# EAGLE design snes_visualization_combi (EAGLE 9.6.2)

## Sheet 1 of 2
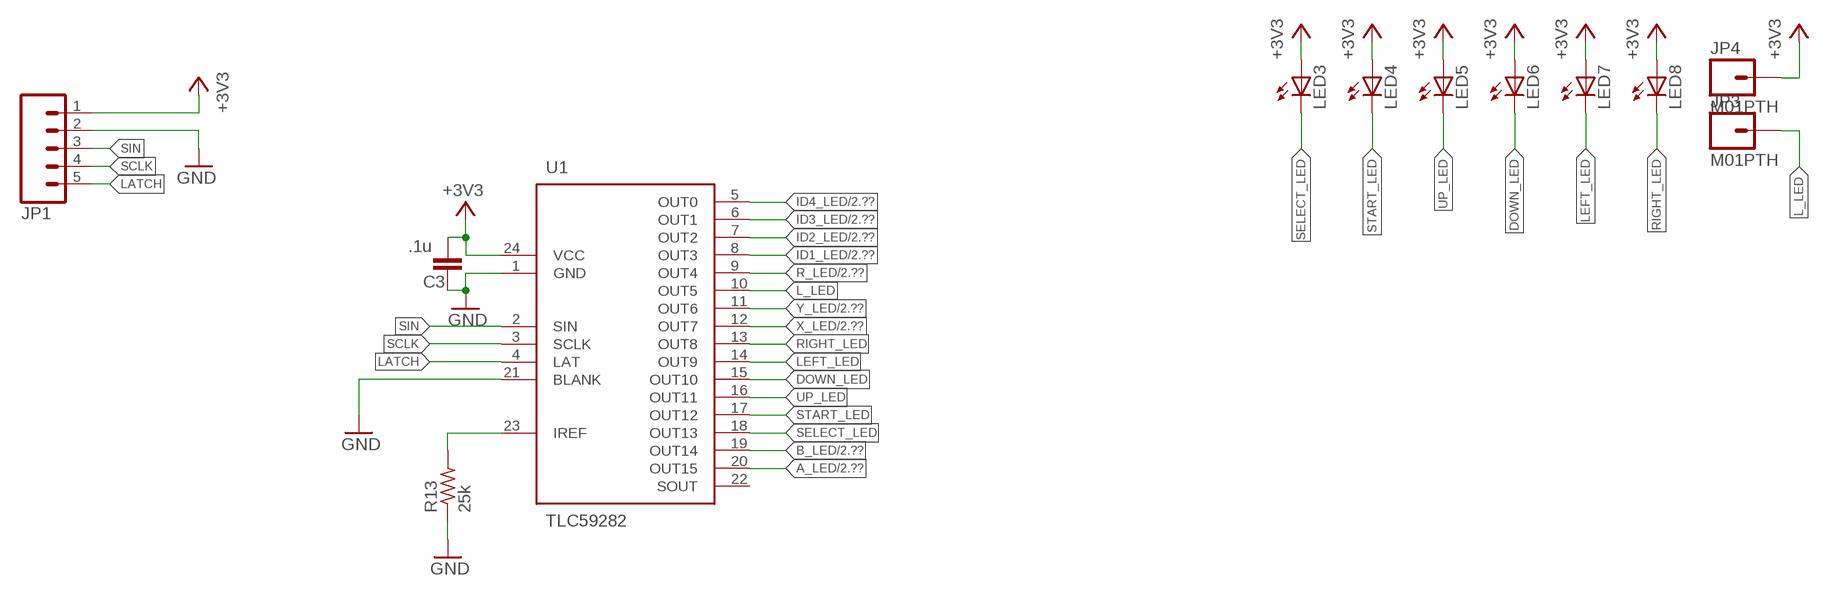
[diagram p0: schematic, sheet 1]

### Parts
C3  .1u  C-EUC0603  [C0603]
JP1  M05PTH  [1X05]
JP3  M01PTH  [1X01]
JP4  M01PTH  [1X01]
LED3  LED3MM  [LED3MM]
LED4  LED3MM  [LED3MM]
LED5  LED5MM  [LED5MM]
LED6  LED5MM  [LED5MM]
LED7  LED5MM  [LED5MM]
LED8  LED5MM  [LED5MM]
R13  25k  R-US_R0805  [R0805]
U1  TLC59282  [R-PDSO-G24]

### Nets
+3V3: C3.1 JP1.1 JP4.1 LED3.A LED4.A LED5.A LED6.A LED7.A LED8.A U1.24(VCC) ; also sheet 2
A_LED: U1.20(OUT15) ; also sheet 2
B_LED: U1.19(OUT14) ; also sheet 2
DOWN_LED: LED6.K(C) U1.15(OUT10)
GND: C3.2 JP1.2 R13.1 U1.1(GND) U1.21(BLANK)
ID1_LED: U1.8(OUT3) ; also sheet 2
ID2_LED: U1.7(OUT2) ; also sheet 2
ID3_LED: U1.6(OUT1) ; also sheet 2
ID4_LED: U1.5(OUT0) ; also sheet 2
L_LED: JP3.1 U1.10(OUT5)
LATCH: JP1.5 U1.4(LAT)
LEFT_LED: LED7.K(C) U1.14(OUT9)
N$5: R13.2 U1.23(IREF)
R_LED: U1.9(OUT4) ; also sheet 2
RIGHT_LED: LED8.K(C) U1.13(OUT8)
SCLK: JP1.4 U1.3(SCLK)
SELECT_LED: LED3.K(C) U1.18(OUT13)
SIN: JP1.3 U1.2(SIN)
START_LED: LED4.K(C) U1.17(OUT12)
UP_LED: LED5.K(C) U1.16(OUT11)
X_LED: U1.12(OUT7) ; also sheet 2
Y_LED: U1.11(OUT6) ; also sheet 2
Unconnected: U1.22(SOUT)

## Sheet 2 of 2
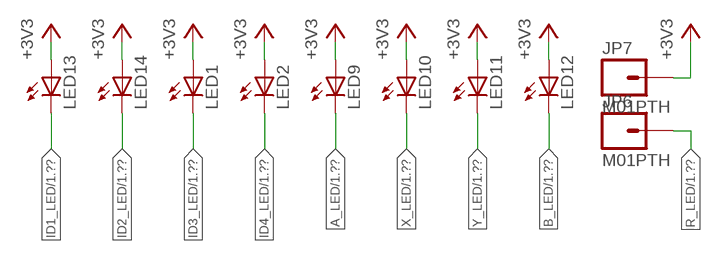
[diagram p1: schematic, sheet 2]

### Parts
JP6  M01PTH  [1X01]
JP7  M01PTH  [1X01]
LED1  LED5MM  [LED5MM]
LED2  LED5MM  [LED5MM]
LED9  LED5MM  [LED5MM]
LED10  LED5MM  [LED5MM]
LED11  LED5MM  [LED5MM]
LED12  LED5MM  [LED5MM]
LED13  LED5MM  [LED5MM]
LED14  LED5MM  [LED5MM]

### Nets
+3V3: JP7.1 LED1.A LED2.A LED9.A LED10.A LED11.A LED12.A LED13.A LED14.A ; also sheet 1
A_LED: LED9.K(C) ; also sheet 1
B_LED: LED12.K(C) ; also sheet 1
ID1_LED: LED13.K(C) ; also sheet 1
ID2_LED: LED14.K(C) ; also sheet 1
ID3_LED: LED1.K(C) ; also sheet 1
ID4_LED: LED2.K(C) ; also sheet 1
R_LED: JP6.1 ; also sheet 1
X_LED: LED10.K(C) ; also sheet 1
Y_LED: LED11.K(C) ; also sheet 1

## Library data of the parts
C3 = rcl:C-EU: CAPACITOR, European symbol; MOUSER#: 80-C0603C104K5R
JP1 = SparkFun-Connectors:M05: Header 5 Standard 5-pin 0.1" header. Use with straight break away headers (SKU : PRT-00116), right angle break away headers (PRT-00553), swiss pins (PRT-00743), machine pins (PRT-00117), and female headers (PRT-00115). Molex polarized connector foot print use with SKU : PRT-08230 with associated crimp pins and housings.
JP3 JP4 JP6 JP7 = SparkFun-Connectors:M01: Header 1 Standard 1-pin 0.1" header. Use with straight break away headers (SKU : PRT-00116), right angle break away headers (PRT-00553), swiss pins (PRT-00743), machine pins (PRT-00117), and female headers (PRT-00115).
LED1-LED14 = led:LED: LED OSRAM: - CHIPLED LG R971, LG N971, LY N971, LG Q971, LY Q971, LO R971, LY R971 LH N974, LH R974 LS Q976, LO Q976, LY Q976 LO Q996 - Hyper CHIPLED LW Q18S LB Q993, LB Q99A, LB R99A - SideLED LS A670, LO A670, LY A670, LG A670, LP A670 LB A673, LV A673, LT A673, LW A673 LH A674 LY A675 LS A676, LA A676, LO A676, LY A676, LW A676 LS A679, LY A679, LG A679 - Hyper Micro SIDELED® LS Y876, LA Y876, LO Y876, LY Y876 LT Y87S - SmartLED LW L88C, LW L88S LB L89C, LB L89S, LG L890 LS L89K, LO L89K, LY L89K LS L896, LA L896, LO L896, LY L896 - TOPLED LS T670, LO T670, LY T670, LG T670, LP T670 LSG T670, LSP T670, LSY T670, LOP T670, LYG T670 LG T671, LOG T671, LSG T671 LB T673, LV T673, LT T673, LW T673 LH T674 LS T676, LA T676, LO T676, LY T676, LB T676, LH T676, LSB T676, LW T676 LB T67C, LV T67C, LT T67C, LS T67K, LO T67K, LY T67K, LW E67C LS E67B, LA E67B, LO E67B, LY E67B, LB E67C, LV E67C, LT E67C LW T67C LS T679, LY T679, LG T679 LS T770, LO T770, LY T770, LG T770, LP T770 LB T773, LV T773, LT T773, LW T773 LH T774 LS E675, LA E675, LY E675, LS T675 LS T776, LA T776, LO T776, LY T776, LB T776 LHGB T686 LT T68C, LB T68C - Hyper Mini TOPLED® LB M676 - Mini TOPLED Santana® LG M470 LS M47K, LO M47K, LY M47K Source: http://www.osram.convergy.de LUXEON: - LUMILED® LXK2-PW12-R00, LXK2-PW12-S00, LXK2-PW14-U00, LXK2-PW14-V00 LXK2-PM12-R00, LXK2-PM12-S00, LXK2-PM14-U00 LXK2-PE12-Q00, LXK2-PE12-R00, LXK2-PE12-S00, LXK2-PE14-T00, LXK2-PE14-U00 LXK2-PB12-K00, LXK2-PB12-L00, LXK2-PB12-M00, LXK2-PB14-N00, LXK2-PB14-P00, LXK2-PB14-Q00 LXK2-PR12-L00, LXK2-PR12-M00, LXK2-PR14-Q00, LXK2-PR14-R00 LXK2-PD12-Q00, LXK2-PD12-R00, LXK2-PD12-S00 LXK2-PH12-R00, LXK2-PH12-S00 LXK2-PL12-P00, LXK2-PL12-Q00, LXK2-PL12-R00 Source: www.luxeon.com KINGBRIGHT: KA-3528ASYC Source: www.kingbright.com
R13 = rcl:R-US_: RESISTOR, American symbol
U1 = TASLink:TLC59282

## Board
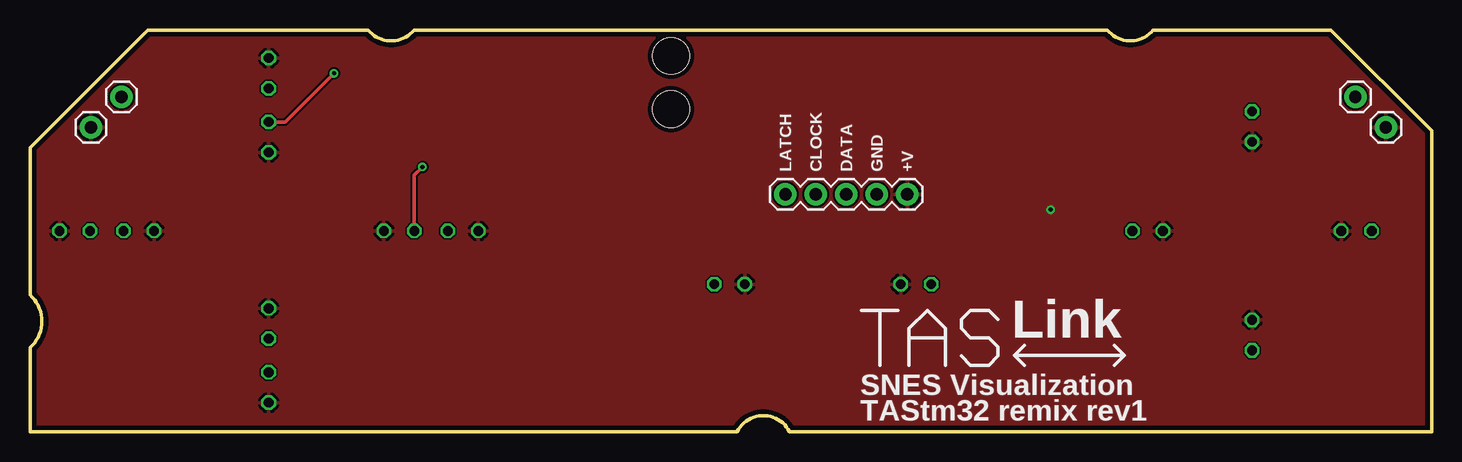
[diagram p2: board, top side]
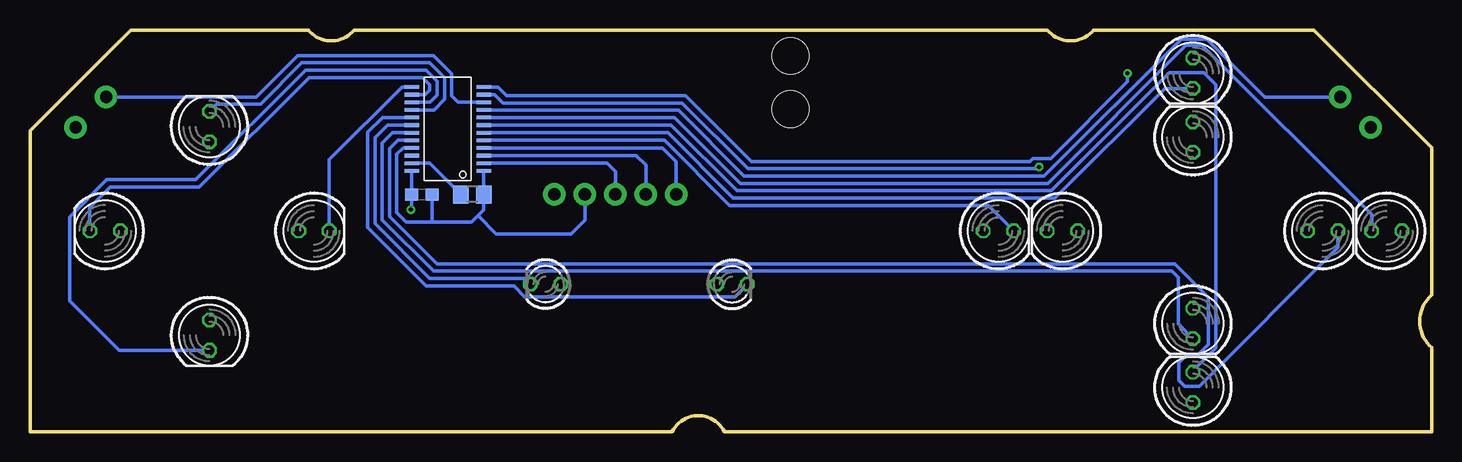
[diagram p3: board, bottom side, seen from below]

Size 116.84 x 33.53 mm. Coordinates in mm from the lower left corner, seen from the top.
Outline: 58.95,0 arc-127 63.32,0 116.84,0 116.84,25.15 108.46,33.53 93.62,33.53 arc-103 89.81,33.53 32.02,33.53 arc-102 28.18,33.53 9.83,33.53 0,23.7 0,11.4 arc-98 0,7.04 0,0 58.95,0
Copper layers (1*16): Top 0.0356mm / dielectric 1.5011mm / Bottom 0.0356mm
Design rules "LaenPCBOrder *": minimum track width 6mil, minimum drill 13mil, track to track 6mil, track to pad 6mil, pad to pad 6mil, via to via 6mil, smd to smd 6mil, copper to edge 15mil, drill to drill 6mil, minimum pad ring 7mil, minimum via ring 7mil, stop-mask expansion 3mil, vias tented up to drill 24mil, thermal gap 10mil
Holes 3.05 mm at 53.44,31.37 53.44,26.92

### Footprints (pad centres in the part's own frame; a part is rotated, then mirrored left to right if it is on the bottom)
C0603 = smd 1.1 x 1: 1 -0.85,0; 2 0.85,0
1X05 = drill 1.016 pad 1.88: 1 0,0; 2 2.54,0; 3 5.08,0; 4 7.62,0; 5 10.16,0
1X01 = drill 1.016 pad 1.88: 1 0,0
LED5MM = drill 0.813 octagon: A -1.27,0; K 1.27,0
LED3MM = drill 0.813 octagon: A -1.27,0; K 1.27,0
R0805 = smd 1.3 x 1.5: 1 -0.95,0; 2 0.95,0
R-PDSO-G24 = smd 0.3 x 1.2: 1 -3.493,-3; 2 -2.857,-3; 3 -2.223,-3; 4 -1.587,-3; 5 -0.953,-3; 6 -0.318,-3; 7 0.318,-3; 8 0.953,-3; 9 1.587,-3; 10 2.223,-3; 11 2.857,-3; 12 3.493,-3; 13 3.493,3; 14 2.857,3; 15 2.223,3; 16 1.587,3; 17 0.953,3; 18 0.318,3; 19 -0.318,3; 20 -0.953,3; 21 -1.587,3; 22 -2.223,3; 23 -2.857,3; 24 -3.493,3

### Placement (x,y rotation side)
C3  84.17,19.81 0 bottom
JP1  73.13,19.81 180 top
JP3  110.49,27.94 0 top
JP4  113.03,25.4 0 top
JP6  7.62,27.94 0 top
JP7  5.08,25.4 0 top
LED1  19.9,29.92 270 bottom
LED2  36.1,16.76 0 bottom
LED3  73.86,12.32 180 bottom
LED4  58.31,12.32 0 bottom
LED5  101.88,25.46 90 bottom
LED6  101.88,8.06 270 bottom
LED7  110.57,16.76 180 bottom
LED8  93.18,16.76 0 bottom
LED9  9.07,16.76 0 bottom
LED10  19.9,24.59 90 bottom
LED11  30.77,16.76 180 bottom
LED12  19.9,9.04 270 bottom
LED13  3.74,16.76 180 bottom
LED14  19.9,3.7 90 bottom
R13  79.97,19.81 180 bottom
U1  82.02,25.27 90 bottom

### Tracks (layer width: path | path; a pad name or v marks a point on that pad's centre or on a via)
+3V3  (via drill 0.35)
  Bottom 0.305: U1.24 C3.1 85.02,18.61 v85.09,18.54
  pour Top: 0,0 0,25.4 10.16,35.56 109.22,35.56 119.38,25.4 119.38,-2.54 0,-2.54
A_LED
  Bottom 0.305: U1.20 86.17,24.32 86.87,23.62 86.87,17.98 82.91,14.02 21.39,14.02 18.59,11.23 18.59,7.32 19.56,6.35 20.47,6.35 21.08,5.74 21.08,4.32 20.57,3.81 19.36,3.81 7.8,15.37 LED9.K
B_LED
  Bottom 0.305: U1.19 86.6,24.96 87.48,24.08 87.48,17.68 83.21,13.41 21.64,13.41 21.12,12.89 21.12,8.99 LED12.K
DOWN_LED
  Bottom 0.305: U1.15 83.5,27.5 82.91,28.09 82.91,29.26 83.82,30.18 93.88,30.18 103.02,21.03 110.44,21.03 113.54,17.93 113.54,10.92 109.41,6.79 LED6.K
GND
  Bottom 0.305: U1.1 R13.1 79.02,18.52 79.5,18.03 | 79.5,18.03 80.01,17.53 83.21,17.53 | JP1.2 70.59,17.68 71.75,16.51 77.98,16.51 79.5,18.03 | 83.21,17.53 85.5,17.53 86.26,18.29 86.26,23.16 85.74,23.69 U1.21 | 83.21,17.53 83.32,17.63 C3.2
ID1_LED
  Bottom 0.305: LED13.K 5.01,18.11 19.15,32.26 20.47,32.26 32,20.73 57.61,20.73 63.09,26.21 79,26.21 U1.8
ID2_LED
  Bottom 0.305: LED14.K 19.9,5.1 17.98,7.01 17.98,28.96 19,29.97 21.84,29.97 31.7,20.12 57.91,20.12 63.39,25.59 U1.7
ID3_LED
  Bottom 0.305: LED1.K 22.25,28.65 31.39,19.51 58.22,19.51 63.66,24.96 U1.6
ID4_LED
  Bottom 0.305: LED2.K 36.96,18.9 58.52,18.9 63.94,24.32 U1.5
L_LED
  Bottom 0.305: JP3.1 97.99,27.94 94.54,31.39 83.21,31.39 81.69,29.87 81.69,28.04 81.14,27.5 U1.10
LATCH
  Bottom 0.305: JP1.5 62.97,22.55 64.1,23.69 U1.4
LEFT_LED
  Bottom 0.305: U1.14 83.88,28.13 83.52,28.5 83.52,28.96 84.12,29.57 93.57,29.57 102.72,20.42 110.13,20.42 111.84,18.71 LED7.K
N$5
  Bottom 0.305: R13.2 83.52,22.42 U1.23
R_LED
  Bottom 0.305: JP6.1 13.92,27.94 18.75,32.77 20.88,32.77 32.31,21.34 57.3,21.34 62.79,26.82 78.98,26.82 U1.9
RIGHT_LED
  Bottom 0.305: U1.13 85.84,28.77 91.91,22.7 LED8.K
SCLK
  Bottom 0.305: JP1.4 65.51,22.25 66.31,23.05 U1.3
SELECT_LED
  Bottom 0.305: LED3.K 75.61,12.8 83.52,12.8 88.09,17.37 88.09,24.54 87.03,25.59 U1.18
SIN
  Bottom 0.305: JP1.3 68.05,21.72 68.75,22.42 U1.2
START_LED
  Bottom 0.305: U1.17 87.47,26.23 88.7,24.99 88.7,17.07 83.82,12.19 76.5,12.19 75.59,11.28 58.09,11.28 LED4.K
UP_LED
  Bottom 0.305: U1.16 83.17,26.86 82.3,27.74 82.3,29.57 83.52,30.79 94.18,30.79 97.62,27.34 101.27,27.34 LED5.K
X_LED  (via drill 0.35)
  Top 0.305: v25.35,29.92 21.28,25.86 LED10.K
  Bottom 0.305: v25.35,29.92 25.35,29.21 31.75,22.81 33.22,22.81 33.48,22.55 56.69,22.55 62.18,28.04 77.11,28.04 77.84,28.77 U1.12
Y_LED  (via drill 0.35)
  Top 0.305: v32.72,22.1 32.04,21.42 LED11.K
  Bottom 0.305: v32.72,22.1 32.72,21.95 57,21.95 62.48,27.43 77.42,27.43 78.12,28.13 U1.11

### Text on the board
tPlace: LATCH | CLOCK | DATA | GND | +V | Link | SNES Visualization | TAStm32 remix rev1